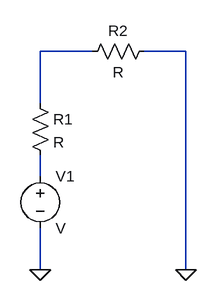
[diagram p0: schematic Draft1.asc]
Draft1.asc, the LTspice schematic file:
Version 4
SHEET 1 880 768
WIRE 464 416 384 416
WIRE 608 416 544 416
WIRE 384 496 384 416
WIRE 384 608 384 576
WIRE 384 752 384 688
WIRE 608 752 608 416
FLAG 384 752 0
FLAG 608 752 0
SYMBOL Res 368 480 R0
SYMATTR InstName R1
SYMBOL Res 560 400 R90
WINDOW 0 0 56 VBottom 2
WINDOW 3 32 56 VTop 2
SYMATTR InstName R2
SYMBOL voltage 384 592 R0
SYMATTR InstName V1

The netlist it stands for:
* Draft1.asc
R1 N001 N002 R
R2 0 N001 R
V1 N002 0 V
.backanno
.end